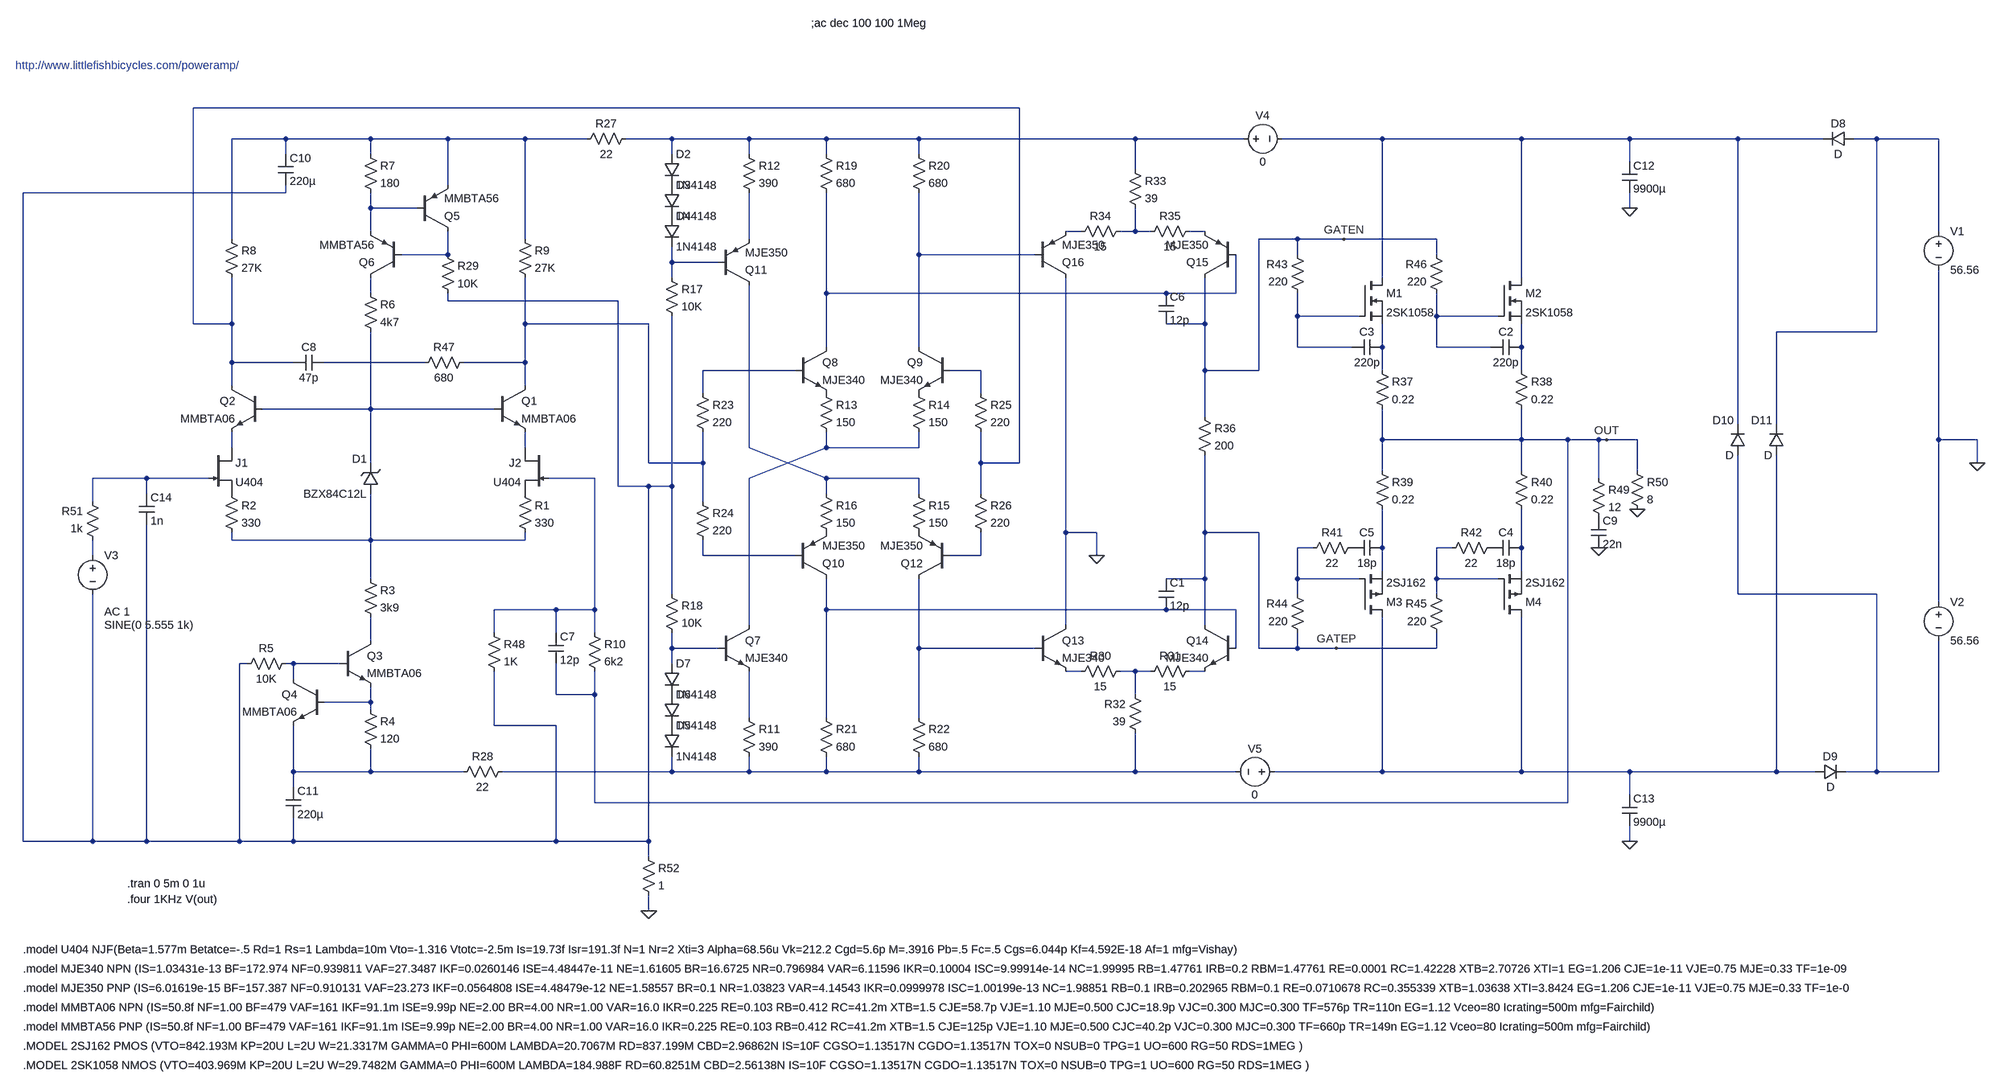
[diagram p0: schematic PowerAmp.asc]
PowerAmp.asc, the LTspice schematic file:
Version 4
SHEET 1 7396 1520
WIRE 3072 -1216 1360 -1216
WIRE 1552 -1152 1440 -1152
WIRE 1728 -1152 1552 -1152
WIRE 1888 -1152 1728 -1152
WIRE 2048 -1152 1888 -1152
WIRE 2176 -1152 2048 -1152
WIRE 2352 -1152 2256 -1152
WIRE 2512 -1152 2352 -1152
WIRE 2672 -1152 2512 -1152
WIRE 2864 -1152 2672 -1152
WIRE 3312 -1152 2864 -1152
WIRE 3536 -1152 3312 -1152
WIRE 3824 -1152 3616 -1152
WIRE 4112 -1152 3824 -1152
WIRE 4336 -1152 4112 -1152
WIRE 4560 -1152 4336 -1152
WIRE 4736 -1152 4560 -1152
WIRE 4848 -1152 4800 -1152
WIRE 4976 -1152 4848 -1152
WIRE 1552 -1120 1552 -1152
WIRE 1728 -1120 1728 -1152
WIRE 2352 -1120 2352 -1152
WIRE 2512 -1120 2512 -1152
WIRE 2672 -1120 2672 -1152
WIRE 2864 -1120 2864 -1152
WIRE 4336 -1104 4336 -1152
WIRE 3312 -1088 3312 -1152
WIRE 1888 -1056 1888 -1152
WIRE 1552 -1040 1552 -1056
WIRE 1552 -1040 1008 -1040
WIRE 1728 -1008 1728 -1040
WIRE 1824 -1008 1728 -1008
WIRE 4336 -1008 4336 -1040
WIRE 1728 -960 1728 -1008
WIRE 3200 -960 3168 -960
WIRE 3312 -960 3312 -1008
WIRE 3312 -960 3280 -960
WIRE 3344 -960 3312 -960
WIRE 3456 -960 3424 -960
WIRE 4976 -960 4976 -1152
WIRE 1440 -944 1440 -1152
WIRE 2048 -944 2048 -1152
WIRE 2512 -944 2512 -1040
WIRE 3648 -944 3568 -944
WIRE 3744 -944 3648 -944
WIRE 3936 -944 3744 -944
WIRE 1888 -912 1888 -960
WIRE 1888 -912 1792 -912
WIRE 2864 -912 2864 -1040
WIRE 3104 -912 2864 -912
WIRE 3648 -912 3648 -944
WIRE 3936 -912 3936 -944
WIRE 2352 -896 2352 -928
WIRE 2448 -896 2352 -896
WIRE 2352 -864 2352 -896
WIRE 3824 -864 3824 -1152
WIRE 4112 -864 4112 -1152
WIRE 1728 -832 1728 -864
WIRE 2672 -832 2672 -1040
WIRE 3376 -832 2672 -832
WIRE 3520 -832 3520 -912
WIRE 3520 -832 3376 -832
WIRE 1888 -816 1888 -832
WIRE 2240 -816 1888 -816
WIRE 3648 -784 3648 -832
WIRE 3776 -784 3648 -784
WIRE 3936 -784 3936 -832
WIRE 4064 -784 3936 -784
WIRE 1360 -768 1360 -1216
WIRE 1440 -768 1440 -864
WIRE 1440 -768 1360 -768
WIRE 2048 -768 2048 -864
WIRE 2304 -768 2048 -768
WIRE 3456 -768 3456 -864
WIRE 3456 -768 3376 -768
WIRE 4848 -752 4848 -1152
WIRE 4848 -752 4640 -752
WIRE 2672 -720 2672 -832
WIRE 2864 -720 2864 -912
WIRE 3648 -720 3648 -784
WIRE 3760 -720 3648 -720
WIRE 3824 -720 3824 -768
WIRE 3936 -720 3936 -784
WIRE 4048 -720 3936 -720
WIRE 4112 -720 4112 -768
WIRE 1440 -688 1440 -768
WIRE 1568 -688 1440 -688
WIRE 1840 -688 1632 -688
WIRE 2048 -688 2048 -768
WIRE 2048 -688 1920 -688
WIRE 2608 -672 2416 -672
WIRE 2992 -672 2928 -672
WIRE 3456 -672 3456 -768
WIRE 3568 -672 3568 -944
WIRE 3568 -672 3456 -672
WIRE 3824 -672 3824 -720
WIRE 4112 -672 4112 -720
WIRE 1440 -640 1440 -688
WIRE 2048 -640 2048 -688
WIRE 2416 -624 2416 -672
WIRE 2992 -624 2992 -672
WIRE 1728 -592 1728 -752
WIRE 1728 -592 1504 -592
WIRE 1984 -592 1728 -592
WIRE 3456 -576 3456 -672
WIRE 4560 -560 4560 -1152
WIRE 4640 -560 4640 -752
WIRE 3824 -528 3824 -592
WIRE 4112 -528 4112 -592
WIRE 4112 -528 3824 -528
WIRE 4208 -528 4112 -528
WIRE 4272 -528 4208 -528
WIRE 4288 -528 4272 -528
WIRE 4352 -528 4288 -528
WIRE 4976 -528 4976 -880
WIRE 5056 -528 4976 -528
WIRE 1440 -512 1440 -544
WIRE 2048 -512 2048 -544
WIRE 2512 -512 2512 -848
WIRE 2672 -512 2672 -544
WIRE 2864 -512 2864 -544
WIRE 2864 -512 2672 -512
WIRE 1728 -480 1728 -592
WIRE 2304 -480 2304 -768
WIRE 2416 -480 2416 -544
WIRE 2416 -480 2304 -480
WIRE 2992 -480 2992 -544
WIRE 3072 -480 3072 -1216
WIRE 3072 -480 2992 -480
WIRE 5056 -480 5056 -528
WIRE 3824 -464 3824 -528
WIRE 4112 -464 4112 -528
WIRE 4352 -464 4352 -528
WIRE 1264 -448 1152 -448
WIRE 1392 -448 1264 -448
WIRE 2192 -448 2096 -448
WIRE 2512 -448 2672 -512
WIRE 2672 -448 2512 -512
WIRE 2864 -448 2672 -448
WIRE 4272 -448 4272 -528
WIRE 2240 -432 2240 -816
WIRE 2304 -432 2240 -432
WIRE 2352 -432 2352 -784
WIRE 2352 -432 2304 -432
WIRE 1264 -416 1264 -448
WIRE 2672 -416 2672 -448
WIRE 2864 -416 2864 -448
WIRE 2992 -416 2992 -480
WIRE 1152 -400 1152 -448
WIRE 2416 -400 2416 -480
WIRE 3168 -336 3168 -864
WIRE 3232 -336 3168 -336
WIRE 3456 -336 3456 -496
WIRE 3568 -336 3456 -336
WIRE 1440 -320 1440 -336
WIRE 1728 -320 1728 -416
WIRE 1728 -320 1440 -320
WIRE 2048 -320 2048 -336
WIRE 2048 -320 1728 -320
WIRE 3680 -304 3648 -304
WIRE 3824 -304 3824 -384
WIRE 3968 -304 3936 -304
WIRE 4112 -304 4112 -384
WIRE 1152 -288 1152 -320
WIRE 2416 -288 2416 -320
WIRE 2608 -288 2416 -288
WIRE 2992 -288 2992 -336
WIRE 2992 -288 2928 -288
WIRE 3232 -288 3232 -336
WIRE 3824 -256 3824 -304
WIRE 4112 -256 4112 -304
WIRE 1728 -240 1728 -320
WIRE 3456 -240 3456 -336
WIRE 3456 -240 3376 -240
WIRE 3648 -240 3648 -304
WIRE 3776 -240 3648 -240
WIRE 3936 -240 3936 -304
WIRE 4064 -240 3936 -240
WIRE 2352 -208 2352 -432
WIRE 3648 -208 3648 -240
WIRE 3936 -208 3936 -240
WIRE 4560 -208 4560 -496
WIRE 4848 -208 4560 -208
WIRE 4976 -192 4976 -528
WIRE 2112 -176 1984 -176
WIRE 2192 -176 2192 -448
WIRE 2192 -176 2112 -176
WIRE 2672 -176 2672 -240
WIRE 3376 -176 2672 -176
WIRE 3520 -176 3376 -176
WIRE 2512 -144 2512 -448
WIRE 3168 -144 3168 -336
WIRE 3456 -144 3456 -240
WIRE 1984 -128 1984 -176
WIRE 2112 -128 2112 -176
WIRE 2192 -128 2192 -176
WIRE 1728 -112 1728 -160
WIRE 2352 -96 2352 -128
WIRE 2448 -96 2352 -96
WIRE 2864 -96 2864 -240
WIRE 3104 -96 2864 -96
WIRE 3520 -96 3520 -176
WIRE 3568 -96 3568 -336
WIRE 3648 -96 3648 -128
WIRE 3648 -96 3568 -96
WIRE 3728 -96 3648 -96
WIRE 3936 -96 3936 -128
WIRE 3936 -96 3728 -96
WIRE 1472 -64 1456 -64
WIRE 1568 -64 1552 -64
WIRE 1664 -64 1568 -64
WIRE 2352 -64 2352 -96
WIRE 3200 -48 3168 -48
WIRE 3312 -48 3280 -48
WIRE 3344 -48 3312 -48
WIRE 3456 -48 3424 -48
WIRE 1568 -32 1568 -64
WIRE 2112 0 2112 -64
WIRE 2192 0 2192 -48
WIRE 2192 0 2112 0
WIRE 3312 0 3312 -48
WIRE 1728 16 1728 -16
WIRE 1728 16 1632 16
WIRE 1728 32 1728 16
WIRE 2512 48 2512 -48
WIRE 2672 48 2672 -176
WIRE 2864 48 2864 -96
WIRE 1984 64 1984 -48
WIRE 2112 64 1984 64
WIRE 1568 160 1568 64
WIRE 1728 160 1728 112
WIRE 1728 160 1568 160
WIRE 1920 160 1728 160
WIRE 2352 160 2352 128
WIRE 2352 160 2000 160
WIRE 2512 160 2512 128
WIRE 2512 160 2352 160
WIRE 2672 160 2672 128
WIRE 2672 160 2512 160
WIRE 2864 160 2864 128
WIRE 2864 160 2672 160
WIRE 3312 160 3312 80
WIRE 3312 160 2864 160
WIRE 3520 160 3312 160
WIRE 3824 160 3824 -160
WIRE 3824 160 3600 160
WIRE 4112 160 4112 -160
WIRE 4112 160 3824 160
WIRE 4336 160 4112 160
WIRE 4640 160 4640 -496
WIRE 4640 160 4336 160
WIRE 4720 160 4640 160
WIRE 4848 160 4848 -208
WIRE 4848 160 4784 160
WIRE 4976 160 4976 -112
WIRE 4976 160 4848 160
WIRE 1568 192 1568 160
WIRE 4336 208 4336 160
WIRE 2192 224 2192 0
WIRE 4208 224 4208 -528
WIRE 4208 224 2192 224
WIRE 1008 304 1008 -1040
WIRE 1152 304 1152 -208
WIRE 1152 304 1008 304
WIRE 1264 304 1264 -352
WIRE 1264 304 1152 304
WIRE 1456 304 1456 -64
WIRE 1456 304 1264 304
WIRE 1568 304 1568 256
WIRE 1568 304 1456 304
WIRE 2112 304 2112 64
WIRE 2112 304 1568 304
WIRE 2304 304 2304 -432
WIRE 2304 304 2112 304
WIRE 4336 304 4336 272
WIRE 2304 336 2304 304
WIRE 2304 448 2304 416
FLAG 4272 -304 0
FLAG 4352 -384 0
FLAG 5056 -480 0
FLAG 4288 -528 OUT
FLAG 3728 -96 GATEP
FLAG 3744 -944 GATEN
FLAG 2304 448 0
FLAG 4336 304 0
FLAG 3232 -288 0
FLAG 4336 -1008 0
SYMBOL njf 1392 -512 R0
SYMATTR InstName J1
SYMATTR Value U404
SYMBOL njf 2096 -512 M0
SYMATTR InstName J2
SYMATTR Value U404
SYMBOL npn 1984 -640 R0
SYMATTR InstName Q1
SYMATTR Value MMBTA06
SYMBOL npn 1504 -640 M0
SYMATTR InstName Q2
SYMATTR Value MMBTA06
SYMBOL res 2032 -432 R0
SYMATTR InstName R1
SYMATTR Value 330
SYMBOL res 1424 -432 R0
SYMATTR InstName R2
SYMATTR Value 330
SYMBOL zener 1744 -416 R180
WINDOW 0 24 72 Left 0
WINDOW 3 24 0 Left 0
SYMATTR InstName D1
SYMATTR Value BZX84C12L
SYMBOL res 1712 -256 R0
SYMATTR InstName R3
SYMATTR Value 3k9
SYMBOL npn 1664 -112 R0
SYMATTR InstName Q3
SYMATTR Value MMBTA06
SYMBOL npn 1632 -32 M0
SYMATTR InstName Q4
SYMATTR Value MMBTA06
SYMBOL res 1712 16 R0
SYMATTR InstName R4
SYMATTR Value 120
SYMBOL res 1568 -80 R90
WINDOW 0 0 56 VBottom 0
WINDOW 3 32 56 VTop 0
SYMATTR InstName R5
SYMATTR Value 10K
SYMBOL pnp 1824 -960 M180
SYMATTR InstName Q5
SYMATTR Value MMBTA56
SYMBOL pnp 1792 -864 R180
SYMATTR InstName Q6
SYMATTR Value MMBTA56
SYMBOL res 1712 -848 R0
SYMATTR InstName R6
SYMATTR Value 4k7
SYMBOL res 1712 -1136 R0
SYMATTR InstName R7
SYMATTR Value 180
SYMBOL res 1424 -960 R0
SYMATTR InstName R8
SYMATTR Value 27K
SYMBOL res 2032 -960 R0
SYMATTR InstName R9
SYMATTR Value 27K
SYMBOL diode 2336 -1120 R0
SYMATTR InstName D2
SYMATTR Value 1N4148
SYMBOL diode 2336 -1056 R0
SYMATTR InstName D3
SYMATTR Value 1N4148
SYMBOL diode 2336 -992 R0
SYMATTR InstName D4
SYMATTR Value 1N4148
SYMBOL diode 2336 64 R0
SYMATTR InstName D5
SYMATTR Value 1N4148
SYMBOL diode 2336 0 R0
SYMATTR InstName D6
SYMATTR Value 1N4148
SYMBOL diode 2336 -64 R0
SYMATTR InstName D7
SYMATTR Value 1N4148
SYMBOL npn 2448 -144 R0
SYMATTR InstName Q7
SYMATTR Value MJE340
SYMBOL npn 2608 -720 R0
SYMATTR InstName Q8
SYMATTR Value MJE340
SYMBOL npn 2928 -720 M0
SYMATTR InstName Q9
SYMATTR Value MJE340
SYMBOL pnp 2608 -240 M180
SYMATTR InstName Q10
SYMATTR Value MJE350
SYMBOL pnp 2448 -848 M180
SYMATTR InstName Q11
SYMATTR Value MJE350
SYMBOL pnp 2928 -240 R180
SYMATTR InstName Q12
SYMATTR Value MJE350
SYMBOL res 2496 32 R0
SYMATTR InstName R11
SYMATTR Value 390
SYMBOL res 2496 -1136 R0
SYMATTR InstName R12
SYMATTR Value 390
SYMBOL res 2656 -640 R0
SYMATTR InstName R13
SYMATTR Value 150
SYMBOL res 2848 -640 R0
SYMATTR InstName R14
SYMATTR Value 150
SYMBOL res 2848 -432 R0
SYMATTR InstName R15
SYMATTR Value 150
SYMBOL res 2656 -432 R0
SYMATTR InstName R16
SYMATTR Value 150
SYMBOL res 2336 -880 R0
SYMATTR InstName R17
SYMATTR Value 10K
SYMBOL res 2336 -224 R0
SYMATTR InstName R18
SYMATTR Value 10K
SYMBOL res 2656 -1136 R0
SYMATTR InstName R19
SYMATTR Value 680
SYMBOL res 2848 -1136 R0
SYMATTR InstName R20
SYMATTR Value 680
SYMBOL res 2656 32 R0
SYMATTR InstName R21
SYMATTR Value 680
SYMBOL res 2848 32 R0
SYMATTR InstName R22
SYMATTR Value 680
SYMBOL res 2400 -640 R0
SYMATTR InstName R23
SYMATTR Value 220
SYMBOL res 2400 -416 R0
SYMATTR InstName R24
SYMATTR Value 220
SYMBOL res 2976 -640 R0
SYMATTR InstName R25
SYMATTR Value 220
SYMBOL res 2976 -432 R0
SYMATTR InstName R26
SYMATTR Value 220
SYMBOL res 2272 -1168 R90
WINDOW 0 0 56 VBottom 0
WINDOW 3 32 56 VTop 0
SYMATTR InstName R27
SYMATTR Value 22
SYMBOL res 2016 144 R90
WINDOW 0 0 56 VBottom 0
WINDOW 3 32 56 VTop 0
SYMATTR InstName R28
SYMATTR Value 22
SYMBOL res 1872 -928 R0
SYMATTR InstName R29
SYMATTR Value 10K
SYMBOL npn 3104 -144 R0
SYMATTR InstName Q13
SYMATTR Value MJE340
SYMBOL npn 3520 -144 M0
SYMATTR InstName Q14
SYMATTR Value MJE340
SYMBOL res 3296 -64 R90
WINDOW 0 0 56 VBottom 0
WINDOW 3 32 56 VTop 0
SYMATTR InstName R30
SYMATTR Value 15
SYMBOL res 3440 -64 R90
WINDOW 0 0 56 VBottom 0
WINDOW 3 32 56 VTop 0
SYMATTR InstName R31
SYMATTR Value 15
SYMBOL res 3328 96 R180
WINDOW 0 36 76 Left 0
WINDOW 3 36 40 Left 0
SYMATTR InstName R32
SYMATTR Value 39
SYMBOL res 3296 -1104 R0
SYMATTR InstName R33
SYMATTR Value 39
SYMBOL res 3296 -976 R90
WINDOW 0 0 56 VBottom 0
WINDOW 3 32 56 VTop 0
SYMATTR InstName R34
SYMATTR Value 15
SYMBOL res 3440 -976 R90
WINDOW 0 0 56 VBottom 0
WINDOW 3 32 56 VTop 0
SYMATTR InstName R35
SYMATTR Value 15
SYMBOL pnp 3520 -864 R180
SYMATTR InstName Q15
SYMATTR Value MJE350
SYMBOL pnp 3104 -864 M180
SYMATTR InstName Q16
SYMATTR Value MJE350
SYMBOL res 3440 -592 R0
SYMATTR InstName R36
SYMATTR Value 200
SYMBOL nmos 3776 -864 R0
SYMATTR InstName M1
SYMATTR Value 2SK1058
SYMBOL nmos 4064 -864 R0
SYMATTR InstName M2
SYMATTR Value 2SK1058
SYMBOL pmos 3776 -160 M180
SYMATTR InstName M3
SYMATTR Value 2SJ162
SYMBOL pmos 4064 -160 M180
SYMATTR InstName M4
SYMATTR Value 2SJ162
SYMBOL res 3808 -688 R0
SYMATTR InstName R37
SYMATTR Value 0.22
SYMBOL res 4096 -688 R0
SYMATTR InstName R38
SYMATTR Value 0.22
SYMBOL res 3808 -480 R0
SYMATTR InstName R39
SYMATTR Value 0.22
SYMBOL res 4096 -480 R0
SYMATTR InstName R40
SYMATTR Value 0.22
SYMBOL cap 4112 -736 R90
WINDOW 0 0 32 VBottom 0
WINDOW 3 32 32 VTop 0
SYMATTR InstName C2
SYMATTR Value 220p
SYMBOL cap 3824 -736 R90
WINDOW 0 0 32 VBottom 0
WINDOW 3 32 32 VTop 0
SYMATTR InstName C3
SYMATTR Value 220p
SYMBOL cap 4112 -320 R90
WINDOW 0 0 32 VBottom 0
WINDOW 3 32 32 VTop 0
SYMATTR InstName C4
SYMATTR Value 18p
SYMBOL cap 3824 -320 R90
WINDOW 0 0 32 VBottom 0
WINDOW 3 32 32 VTop 0
SYMATTR InstName C5
SYMATTR Value 18p
SYMBOL res 3776 -320 R90
WINDOW 0 0 56 VBottom 0
WINDOW 3 32 56 VTop 0
SYMATTR InstName R41
SYMATTR Value 22
SYMBOL res 4064 -320 R90
WINDOW 0 0 56 VBottom 0
WINDOW 3 32 56 VTop 0
SYMATTR InstName R42
SYMATTR Value 22
SYMBOL res 3664 -816 R180
WINDOW 0 36 76 Left 0
WINDOW 3 36 40 Left 0
SYMATTR InstName R43
SYMATTR Value 220
SYMBOL res 3664 -112 R180
WINDOW 0 36 76 Left 0
WINDOW 3 36 40 Left 0
SYMATTR InstName R44
SYMATTR Value 220
SYMBOL res 3952 -112 R180
WINDOW 0 36 76 Left 0
WINDOW 3 36 40 Left 0
SYMATTR InstName R45
SYMATTR Value 220
SYMBOL res 3952 -816 R180
WINDOW 0 36 76 Left 0
WINDOW 3 36 40 Left 0
SYMATTR InstName R46
SYMATTR Value 220
SYMBOL res 1968 -144 R0
SYMATTR InstName R48
SYMATTR Value 1K
SYMBOL res 4256 -464 R0
SYMATTR InstName R49
SYMATTR Value 12
SYMBOL cap 4256 -368 R0
SYMATTR InstName C9
SYMATTR Value 22n
SYMBOL res 4336 -480 R0
SYMATTR InstName R50
SYMATTR Value 8
SYMBOL voltage 1152 -304 R0
WINDOW 3 24 160 Left 0
WINDOW 123 24 132 Left 0
WINDOW 39 0 0 Left 0
SYMATTR Value SINE(0 5.555 1k)
SYMATTR Value2 AC 1
SYMATTR InstName V3
SYMBOL cap 1536 -1120 R0
SYMATTR InstName C10
SYMATTR Value 220µ
SYMATTR SpiceLine V=100
SYMBOL cap 1552 192 R0
SYMATTR InstName C11
SYMATTR Value 220µ
SYMATTR SpiceLine V=100
SYMBOL res 2176 -144 R0
SYMATTR InstName R10
SYMATTR Value 6k2
SYMBOL cap 3360 -240 R0
SYMATTR InstName C1
SYMATTR Value 12p
SYMBOL cap 3360 -832 R0
SYMATTR InstName C6
SYMATTR Value 12p
SYMBOL cap 2096 -128 R0
SYMATTR InstName C7
SYMATTR Value 12p
SYMBOL cap 1632 -704 R90
WINDOW 0 0 32 VBottom 0
WINDOW 3 32 32 VTop 0
SYMATTR InstName C8
SYMATTR Value 47p
SYMBOL res 1936 -704 R90
WINDOW 0 0 56 VBottom 0
WINDOW 3 32 56 VTop 0
SYMATTR InstName R47
SYMATTR Value 680
SYMBOL res 1168 -304 R180
WINDOW 0 36 76 Left 0
WINDOW 3 36 40 Left 0
SYMATTR InstName R51
SYMATTR Value 1k
SYMBOL voltage 3520 -1152 R270
WINDOW 0 32 56 VTop 0
WINDOW 3 -32 56 VBottom 0
WINDOW 123 0 0 Left 0
WINDOW 39 0 0 Left 0
SYMATTR InstName V4
SYMATTR Value 0
SYMBOL voltage 3616 160 R90
WINDOW 0 -32 56 VBottom 0
WINDOW 3 32 56 VTop 0
WINDOW 123 0 0 Left 0
WINDOW 39 0 0 Left 0
SYMATTR InstName V5
SYMATTR Value 0
SYMBOL voltage 4976 -976 R0
WINDOW 123 24 44 Left 0
WINDOW 39 0 0 Left 0
SYMATTR InstName V1
SYMATTR Value 56.56
SYMBOL voltage 4976 -208 R0
WINDOW 123 24 132 Left 0
WINDOW 39 0 0 Left 0
SYMATTR InstName V2
SYMATTR Value 56.56
SYMBOL diode 4800 -1168 R90
WINDOW 0 0 32 VBottom 0
WINDOW 3 32 32 VTop 0
SYMATTR InstName D8
SYMBOL diode 4720 176 R270
WINDOW 0 32 32 VTop 0
WINDOW 3 0 32 VBottom 0
SYMATTR InstName D9
SYMBOL diode 4576 -496 R180
WINDOW 0 24 72 Left 0
WINDOW 3 24 0 Left 0
SYMATTR InstName D10
SYMBOL diode 4656 -496 R180
WINDOW 0 24 72 Left 0
WINDOW 3 24 0 Left 0
SYMATTR InstName D11
SYMBOL cap 4320 -1104 R0
SYMATTR InstName C12
SYMATTR Value 9900µ
SYMATTR SpiceLine V=80 Rser=0.022
SYMBOL cap 4320 208 R0
SYMATTR InstName C13
SYMATTR Value 9900µ
SYMATTR SpiceLine V=80 Rser=0.022
SYMBOL cap 1248 -416 R0
SYMATTR InstName C14
SYMATTR Value 1n
SYMBOL res 2288 320 R0
SYMATTR InstName R52
SYMATTR Value 1
TEXT 1224 392 Left 0 !.tran 0 5m 0 1u
TEXT 1224 424 Left 0 !.four 1KHz V(out)
TEXT 2640 -1392 Left 0 !;ac dec 100 100 1Meg
TEXT 1008 528 Left 0 !.model U404 NJF(Beta=1.577m Betatce=-.5 Rd=1 Rs=1 Lambda=10m Vto=-1.316 Vtotc=-2.5m Is=19.73f Isr=191.3f N=1 Nr=2 Xti=3 Alpha=68.56u Vk=212.2 Cgd=5.6p M=.3916 Pb=.5 Fc=.5 Cgs=6.044p Kf=4.592E-18 Af=1 mfg=Vishay)
TEXT 1008 568 Left 0 !.model MJE340 NPN (IS=1.03431e-13 BF=172.974 NF=0.939811 VAF=27.3487 IKF=0.0260146 ISE=4.48447e-11 NE=1.61605 BR=16.6725 NR=0.796984 VAR=6.11596 IKR=0.10004 ISC=9.99914e-14 NC=1.99995 RB=1.47761 IRB=0.2 RBM=1.47761 RE=0.0001 RC=1.42228 XTB=2.70726 XTI=1 EG=1.206 CJE=1e-11 VJE=0.75 MJE=0.33 TF=1e-09 XTF=1 VTF=10 ITF=0.01 CJC=1e-11 VJC=0.75 MJC=0.33 XCJC=0.9 FC=0.5 CJS=0 VJS=0.75 MJS=0.5 TR=1e-07 PTF=0 KF=0 AF=1 Vceo=300 Icrating=500m mfg=Fairchild)
TEXT 1008 608 Left 0 !.model MJE350 PNP (IS=6.01619e-15 BF=157.387 NF=0.910131 VAF=23.273 IKF=0.0564808 ISE=4.48479e-12 NE=1.58557 BR=0.1 NR=1.03823 VAR=4.14543 IKR=0.0999978 ISC=1.00199e-13 NC=1.98851 RB=0.1 IRB=0.202965 RBM=0.1 RE=0.0710678 RC=0.355339 XTB=1.03638 XTI=3.8424 EG=1.206 CJE=1e-11 VJE=0.75 MJE=0.33 TF=1e-09 XTF=1 VTF=10 ITF=0.01 CJC=1e-11 VJC=0.75 MJC=0.33 XCJC=0.9 FC=0.5 CJS=0 VJS=0.75 MJS=0.5 TR=1e-07 PTF=0 KF=0 AF=1 Vceo=300 Icrating=500m mfg=Fairchild)
TEXT 1008 648 Left 0 !.model MMBTA06 NPN (IS=50.8f NF=1.00 BF=479 VAF=161 IKF=91.1m ISE=9.99p NE=2.00 BR=4.00 NR=1.00 VAR=16.0 IKR=0.225 RE=0.103 RB=0.412 RC=41.2m XTB=1.5 CJE=58.7p VJE=1.10 MJE=0.500 CJC=18.9p VJC=0.300 MJC=0.300 TF=576p TR=110n EG=1.12 Vceo=80 Icrating=500m mfg=Fairchild)
TEXT 1008 688 Left 0 !.model MMBTA56 PNP (IS=50.8f NF=1.00 BF=479 VAF=161 IKF=91.1m ISE=9.99p NE=2.00 BR=4.00 NR=1.00 VAR=16.0 IKR=0.225 RE=0.103 RB=0.412 RC=41.2m XTB=1.5 CJE=125p VJE=1.10 MJE=0.500 CJC=40.2p VJC=0.300 MJC=0.300 TF=660p TR=149n EG=1.12 Vceo=80 Icrating=500m mfg=Fairchild)
TEXT 1008 768 Left 0 !.MODEL 2SK1058 NMOS (VTO=403.969M KP=20U L=2U W=29.7482M GAMMA=0 PHI=600M LAMBDA=184.988F RD=60.8251M CBD=2.56138N IS=10F CGSO=1.13517N CGDO=1.13517N TOX=0 NSUB=0 TPG=1 UO=600 RG=50 RDS=1MEG )
TEXT 1008 728 Left 0 !.MODEL 2SJ162 PMOS (VTO=842.193M KP=20U L=2U W=21.3317M GAMMA=0 PHI=600M LAMBDA=20.7067M RD=837.199M CBD=2.96862N IS=10F CGSO=1.13517N CGDO=1.13517N TOX=0 NSUB=0 TPG=1 UO=600 RG=50 RDS=1MEG )
TEXT 992 -1304 Left 0 ;http://www.littlefishbicycles.com/poweramp/

The netlist it stands for:
* PowerAmp.asc
J1 N026 N030 P001 U404
J2 N027 N031 P002 U404
Q1 N019 N025 N027 0 MMBTA06
Q2 N001 N025 N026 0 MMBTA06
R1 P002 N032 330
R2 P001 N032 330
D1 N032 N025 BZX84C12L
R3 N032 N042 3k9
Q3 N042 N045 N049 0 MMBTA06
Q4 N045 N049 N051 0 MMBTA06
R4 N049 N051 120
R5 N045 N006 10K
Q5 N012 N007 N002 0 MMBTA56
Q6 N015 N012 N007 0 MMBTA56
R6 N015 N025 4k7
R7 N002 N007 180
R8 N002 N001 27K
R9 N002 N019 27K
D2 N003 P003 1N4148
D3 P003 P004 1N4148
D4 P004 N014 1N4148
D5 P005 N052 1N4148
D6 P006 P005 1N4148
D7 N043 P006 1N4148
Q7 N029 N043 N050 0 MJE340
Q8 N016 N023 P007 0 MJE340
Q9 N013 N024 P008 0 MJE340
Q10 N041 N038 P009 0 MJE350
Q11 N028 N014 N011 0 MJE350
Q12 N044 N039 P010 0 MJE350
R11 N050 N052 390
R12 N003 N011 390
R13 P007 N029 150
R14 P008 N029 150
R15 N028 P010 150
R16 N028 P009 150
R17 N014 N006 10K
R18 N006 N043 10K
R19 N003 N016 680
R20 N003 N013 680
R21 N041 N052 680
R22 N044 N052 680
R23 N023 N019 220
R24 N019 N038 220
R25 N024 N001 220
R26 N001 N039 220
R27 N003 N002 22
R28 N052 N051 22
R29 N012 N006 10K
Q13 0 N044 N046 0 MJE340
Q14 GATEP N041 N048 0 MJE340
R30 N047 N046 15
R31 N048 N047 15
R32 N052 N047 39
R33 N003 N009 39
R34 N009 N008 15
R35 N010 N009 15
Q15 GATEN N016 N010 0 MJE350
Q16 0 N013 N008 0 MJE350
R36 GATEN GATEP 200
M1 N004 N017 N020 N020 2SK1058
M2 N004 N018 N021 N021 2SK1058
M3 N053 N033 N034 N034 2SJ162
M4 N053 N035 N036 N036 2SJ162
R37 N020 OUT 0.22
R38 N021 OUT 0.22
R39 OUT N034 0.22
R40 OUT N036 0.22
C2 N021 N018 220p
C3 N020 N017 220p
C4 N036 P011 18p
C5 N034 P012 18p
R41 P012 N033 22
R42 P011 N035 22
R43 N017 GATEN 220
R44 GATEP N033 220
R45 GATEP N035 220
R46 N018 GATEN 220
R48 N031 N006 1K
R49 OUT P013 12
C9 P013 0 22n
R50 OUT 0 8
V3 N037 N006 SINE(0 5.555 1k) AC 1
C10 N002 N006 220µ V=100
C11 N051 N006 220µ V=100
R10 N031 OUT 6k2
C1 GATEP N041 12p
C6 N016 GATEN 12p
C7 N031 OUT 12p
C8 N022 N001 47p
R47 N019 N022 680
R51 N037 N030 1k
V4 N003 N004 0
V5 N053 N052 0
V1 N005 0 56.56
V2 0 N040 56.56
D8 N005 N004 D
D9 N053 N040 D
D10 N040 N004 D
D11 N053 N005 D
C12 N004 0 9900µ V=80 Rser=0.022
C13 N053 0 9900µ V=80 Rser=0.022
C14 N030 N006 1n
R52 N006 0 1
.model D D
.lib standard.dio
.model NPN NPN
.model PNP PNP
.lib standard.bjt
.model NJF NJF
.model PJF PJF
.lib standard.jft
.model NMOS NMOS
.model PMOS PMOS
.lib standard.mos
.tran 0 5m 0 1u
.four 1KHz V(out)
;ac dec 100 100 1Meg
.model U404 NJF(Beta=1.577m Betatce=-.5 Rd=1 Rs=1 Lambda=10m Vto=-1.316 Vtotc=-2.5m Is=19.73f Isr=191.3f N=1 Nr=2 Xti=3 Alpha=68.56u Vk=212.2 Cgd=5.6p M=.3916 Pb=.5 Fc=.5 Cgs=6.044p Kf=4.592E-18 Af=1 mfg=Vishay)
.model MJE340 NPN (IS=1.03431e-13 BF=172.974 NF=0.939811 VAF=27.3487 IKF=0.0260146 ISE=4.48447e-11 NE=1.61605 BR=16.6725 NR=0.796984 VAR=6.11596 IKR=0.10004 ISC=9.99914e-14 NC=1.99995 RB=1.47761 IRB=0.2 RBM=1.47761 RE=0.0001 RC=1.42228 XTB=2.70726 XTI=1 EG=1.206 CJE=1e-11 VJE=0.75 MJE=0.33 TF=1e-09 XTF=1 VTF=10 ITF=0.01 CJC=1e-11 VJC=0.75 MJC=0.33 XCJC=0.9 FC=0.5 CJS=0 VJS=0.75 MJS=0.5 TR=1e-07 PTF=0 KF=0 AF=1 Vceo=300 Icrating=500m mfg=Fairchild)
.model MJE350 PNP (IS=6.01619e-15 BF=157.387 NF=0.910131 VAF=23.273 IKF=0.0564808 ISE=4.48479e-12 NE=1.58557 BR=0.1 NR=1.03823 VAR=4.14543 IKR=0.0999978 ISC=1.00199e-13 NC=1.98851 RB=0.1 IRB=0.202965 RBM=0.1 RE=0.0710678 RC=0.355339 XTB=1.03638 XTI=3.8424 EG=1.206 CJE=1e-11 VJE=0.75 MJE=0.33 TF=1e-09 XTF=1 VTF=10 ITF=0.01 CJC=1e-11 VJC=0.75 MJC=0.33 XCJC=0.9 FC=0.5 CJS=0 VJS=0.75 MJS=0.5 TR=1e-07 PTF=0 KF=0 AF=1 Vceo=300 Icrating=500m mfg=Fairchild)
.model MMBTA06 NPN (IS=50.8f NF=1.00 BF=479 VAF=161 IKF=91.1m ISE=9.99p NE=2.00 BR=4.00 NR=1.00 VAR=16.0 IKR=0.225 RE=0.103 RB=0.412 RC=41.2m XTB=1.5 CJE=58.7p VJE=1.10 MJE=0.500 CJC=18.9p VJC=0.300 MJC=0.300 TF=576p TR=110n EG=1.12 Vceo=80 Icrating=500m mfg=Fairchild)
.model MMBTA56 PNP (IS=50.8f NF=1.00 BF=479 VAF=161 IKF=91.1m ISE=9.99p NE=2.00 BR=4.00 NR=1.00 VAR=16.0 IKR=0.225 RE=0.103 RB=0.412 RC=41.2m XTB=1.5 CJE=125p VJE=1.10 MJE=0.500 CJC=40.2p VJC=0.300 MJC=0.300 TF=660p TR=149n EG=1.12 Vceo=80 Icrating=500m mfg=Fairchild)
.MODEL 2SK1058 NMOS (VTO=403.969M KP=20U L=2U W=29.7482M GAMMA=0 PHI=600M LAMBDA=184.988F RD=60.8251M CBD=2.56138N IS=10F CGSO=1.13517N CGDO=1.13517N TOX=0 NSUB=0 TPG=1 UO=600 RG=50 RDS=1MEG )
.MODEL 2SJ162 PMOS (VTO=842.193M KP=20U L=2U W=21.3317M GAMMA=0 PHI=600M LAMBDA=20.7067M RD=837.199M CBD=2.96862N IS=10F CGSO=1.13517N CGDO=1.13517N TOX=0 NSUB=0 TPG=1 UO=600 RG=50 RDS=1MEG )
* http://www.littlefishbicycles.com/poweramp/
.backanno
.end